# Altium schematic sheet Clocks.SchDoc
size A4; DocumentNumber: 2; SheetNumber: ALT0056; SheetTotal: 21
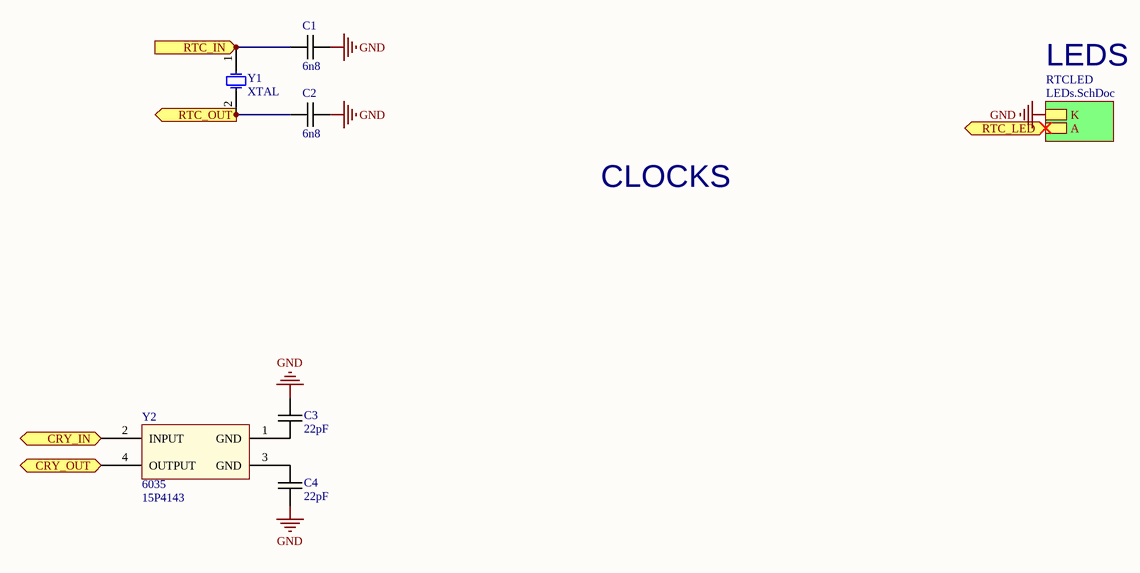
[diagram p0: Clocks.SchDoc]

## Parts
C1  6n8  [0603C-GENERIC]
C2  6n8  [0603C-GENERIC]
C3  22pF  [0603C-GENERIC]
C4  22pF  [0603C-GENERIC]
Y1  XTAL  [R38]
Y2  6035  Supplier Part Number 1: 15P4143  [XTAL 6035]

## Sub-sheets
RTCLED = LEDs.SchDoc: K, A

## Ports
CRY_IN (in), CRY_OUT (out), RTC_IN (in), RTC_LED (in), RTC_OUT (out)

## Nets
GND: C1.1 C2.1 C3.1 C4.2 ; sheet RTCLED/K
CRY_IN: Y2.2(INPUT) ; port CRY_IN
CRY_OUT: Y2.4(OUTPUT) ; port CRY_OUT
RTC_IN: C1.2 Y1.1(OSC1) ; port RTC_IN
RTC_LED: port RTC_LED, sheet RTCLED/A
RTC_OUT: C2.2 Y1.2(OSC2) ; port RTC_OUT
NetC3_2: C3.2 Y2.1(GND)
NetC4_1: C4.1 Y2.3(GND)

## Notes on the sheet
- LEDS
- CLOCKS
- Title
- Size:
- Date:
- A4
- Number:
- Time:
- Revision:
- Sheet
- of
- File:

## Library data of the parts
C1 C2 = 0603C-6N850V-X7R-MUR: CAPACITOR 0603 CERAMIC; Manufacturer: Murata Electronics North America; Manufacturer Part Number: GRM188R71H682KA01D; Reel: C35; Supplier 1: Digi-Key; Supplier Part Number 1: 490-1508-2-ND
C3 C4 = 0603C-22PF-50V-C0G-PAN: CAPACITOR 0603 CERAMIC; Manufacturer Part Number: ECJ-1VC1H220J; Manufacturer: Panasonic - ECG; Reel: C10; Tolerance: ±5%; Temperature Coefficient: C0G, NP0; Voltage - Rated: 50V; Supplier 1: Digi-Key; Features: General Purpose; Lead Spacing: -; Supplier: Digi-Key; Capacitance: 22pF; Packaging: Tape & Reel (TR); Mounting Type: Surface Mount, MLCC; RoHS: RoHS Compliant; Operating Temperature: -55°C ~ 125°C; Thickness: 0.80mm; Package / Case: 0603 (1608 metric); Category: Capacitors; Supplier Part Number 1: PCC220ACVTR-ND; Supplier Part Number: PCC220ACVTR-ND
Y1 = XTAL: Crystal Oscillator; Published: 8-Jun-2000; LatestRevisionDate: 17-Jul-2002; LatestRevisionNote: Re-released for DXP Platform.; PackageReference: R38; Publisher: Altium Limited; PackageDescription: Crystal, Thru-Hole; 2 Leads; Body 3.1 x 8.2 mm (Dia.xH)
Y2 = 6035 Quartz: Supplier 1: Newark